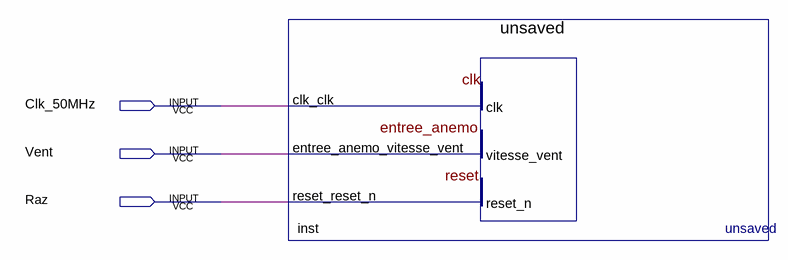
[diagram p0: schematic sheet]
// Quartus schematic block1.bdf as structural Verilog: 1 symbols, 3 pins
module block1 (
  input  Clk_50MHz,
  input  Vent,
  input  Raz
);

  unsaved inst (.clk_clk(Clk_50MHz), .entree_anemo_vitesse_vent(Vent), .reset_reset_n(Raz));
endmodule
